# Altium schematic sheet FTDI_interface.SchDoc
size A
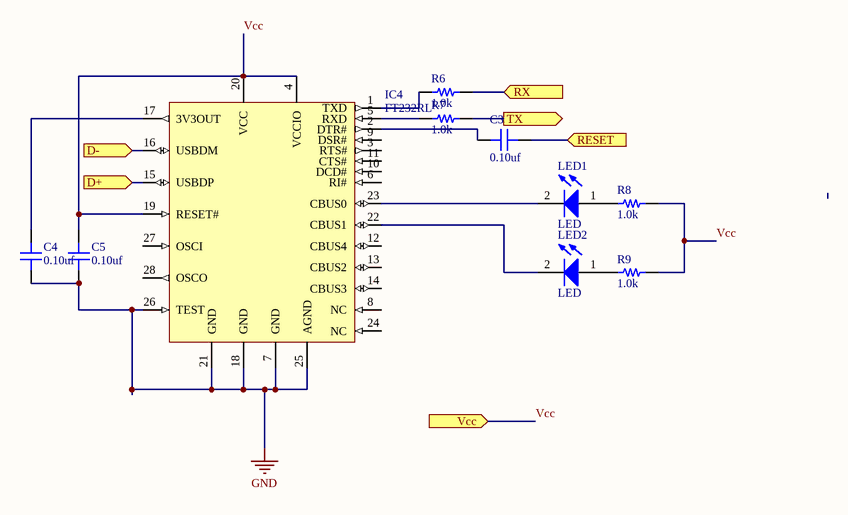
[diagram p0: FTDI_interface.SchDoc]

## Parts
C3  value 0.10uf  [CAP 0805/2012]  (hidden comment: Capacitor MLCC 0.10uf 16V CAP 0805/2012)
C4  value 0.10uf  [CAP 0805/2012]  (hidden comment: Capacitor MLCC 0.10uf 16V CAP 0805/2012)
C5  value 0.10uf  [CAP 0805/2012]  (hidden comment: Capacitor MLCC 0.10uf 16V CAP 0805/2012)
IC4  FT232RL  [SSOP-28]
LED1  LED  [0805_LED]
LED2  LED  [0805_LED]
R6  value 1.0k  [RES 0805/2012]  (hidden comment: Resistor 1.0k 0805 1/4W 1%)
R7  value 1.0k  [RES 0805/2012]  (hidden comment: Resistor 1.0k 0805 1/4W 1%)
R8  value 1.0k  [RES 0805/2012]  (hidden comment: Resistor 1.0k 0805 1/4W 1%)
R9  value 1.0k  [RES 0805/2012]  (hidden comment: Resistor 1.0k 0805 1/4W 1%)

## Ports
D+ (in), D- (in), RESET (in), RX (in), TX (out), Vcc (in)

## Nets
GND: C4.1 C5.1 IC4.7(GND) IC4.18(GND) IC4.21(GND) IC4.25(AGND) IC4.26(TEST)
D+: IC4.15(USBDP) ; port D+
D-: IC4.16(USBDM) ; port D-
RESET: C3.2 ; port RESET
RX: R6.2 ; port RX
TX: R7.2 ; port TX
Vcc: C5.2 IC4.4(VCCIO) IC4.19(RESET#) IC4.20(VCC) R8.2 R9.2 ; port Vcc
NetC3_1: C3.1 IC4.2(DTR#)
NetC4_2: C4.2 IC4.17(3V3OUT)
NetIC4_1: IC4.1(TXD) R6.1
NetIC4_5: IC4.5(RXD) R7.1
NetIC4_22: IC4.22(CBUS1) LED2.2(K)
NetIC4_23: IC4.23(CBUS0) LED1.2(K)
NetLED1_1: LED1.1(A) R8.1
NetLED2_1: LED2.1(A) R9.1

Not connected (* = marked no-connect by the designer): IC4 3(RTS#) 6(RI#) 8(NC) 9(DSR#) 10(DCD#) 11(CTS#) 12(CBUS4) 13(CBUS2) 14(CBUS3) 24(NC) 27(OSCI) 28(OSCO)

## Library data of the parts
C3-C5 = 343: Manufacturer_id: 1; idCapacitor: 343; Name: Cap_0.10uf_16V_CAP 0805/2012; Dielectric: Ceramic; Created_By: Nick Mah; Drawer_id: 1; Voltage_Rating: 16V; Package: CAP 0805/2012; Created_Date: 10/20/2018
IC4 = 3: Manufacturer_id: 1; idIC_Interface: 3; Name: USB FTDI; Protocol: UART; Vin(Min): 3.3; Vin(Max): 5.25; Created_By: Kyle; Drawer_id: 1; MfrPartNo: FT232RL; Link: https://www.digikey.com/product-detail/en/ftdi-future-technology-devices-international-ltd/FT232RL-REEL/768-1007-1-ND/1836402
LED1 = 2: Manufacturer_id: 1; idLED: 2; Name: LED_0805_GREEN; Value: Green; Brightness: 35mcd; Id: 20mA; Vf: 2V; Drawer_id: 1
LED2 = 1: idLED: 1; Name: LED_0805_RED; Value: Red; Vf: 0.7V; Manufacturer_id: 1; Drawer_id: 1
R6-R9 = 721: Manufacturer_id: 1; idResistor: 721; Name: Res_1.0k_0805_1/4W_1%; Created_By: Nick Mah; Supplier 1: Digi-Key; Drawer_id: 1; Tolerance: 1%; Power: 1/4W; Package: 0805; ComponentLink1Description: Datasheet; Created_Date: 2018-10-20